# Altium project SunS_main_board.PrjPcb
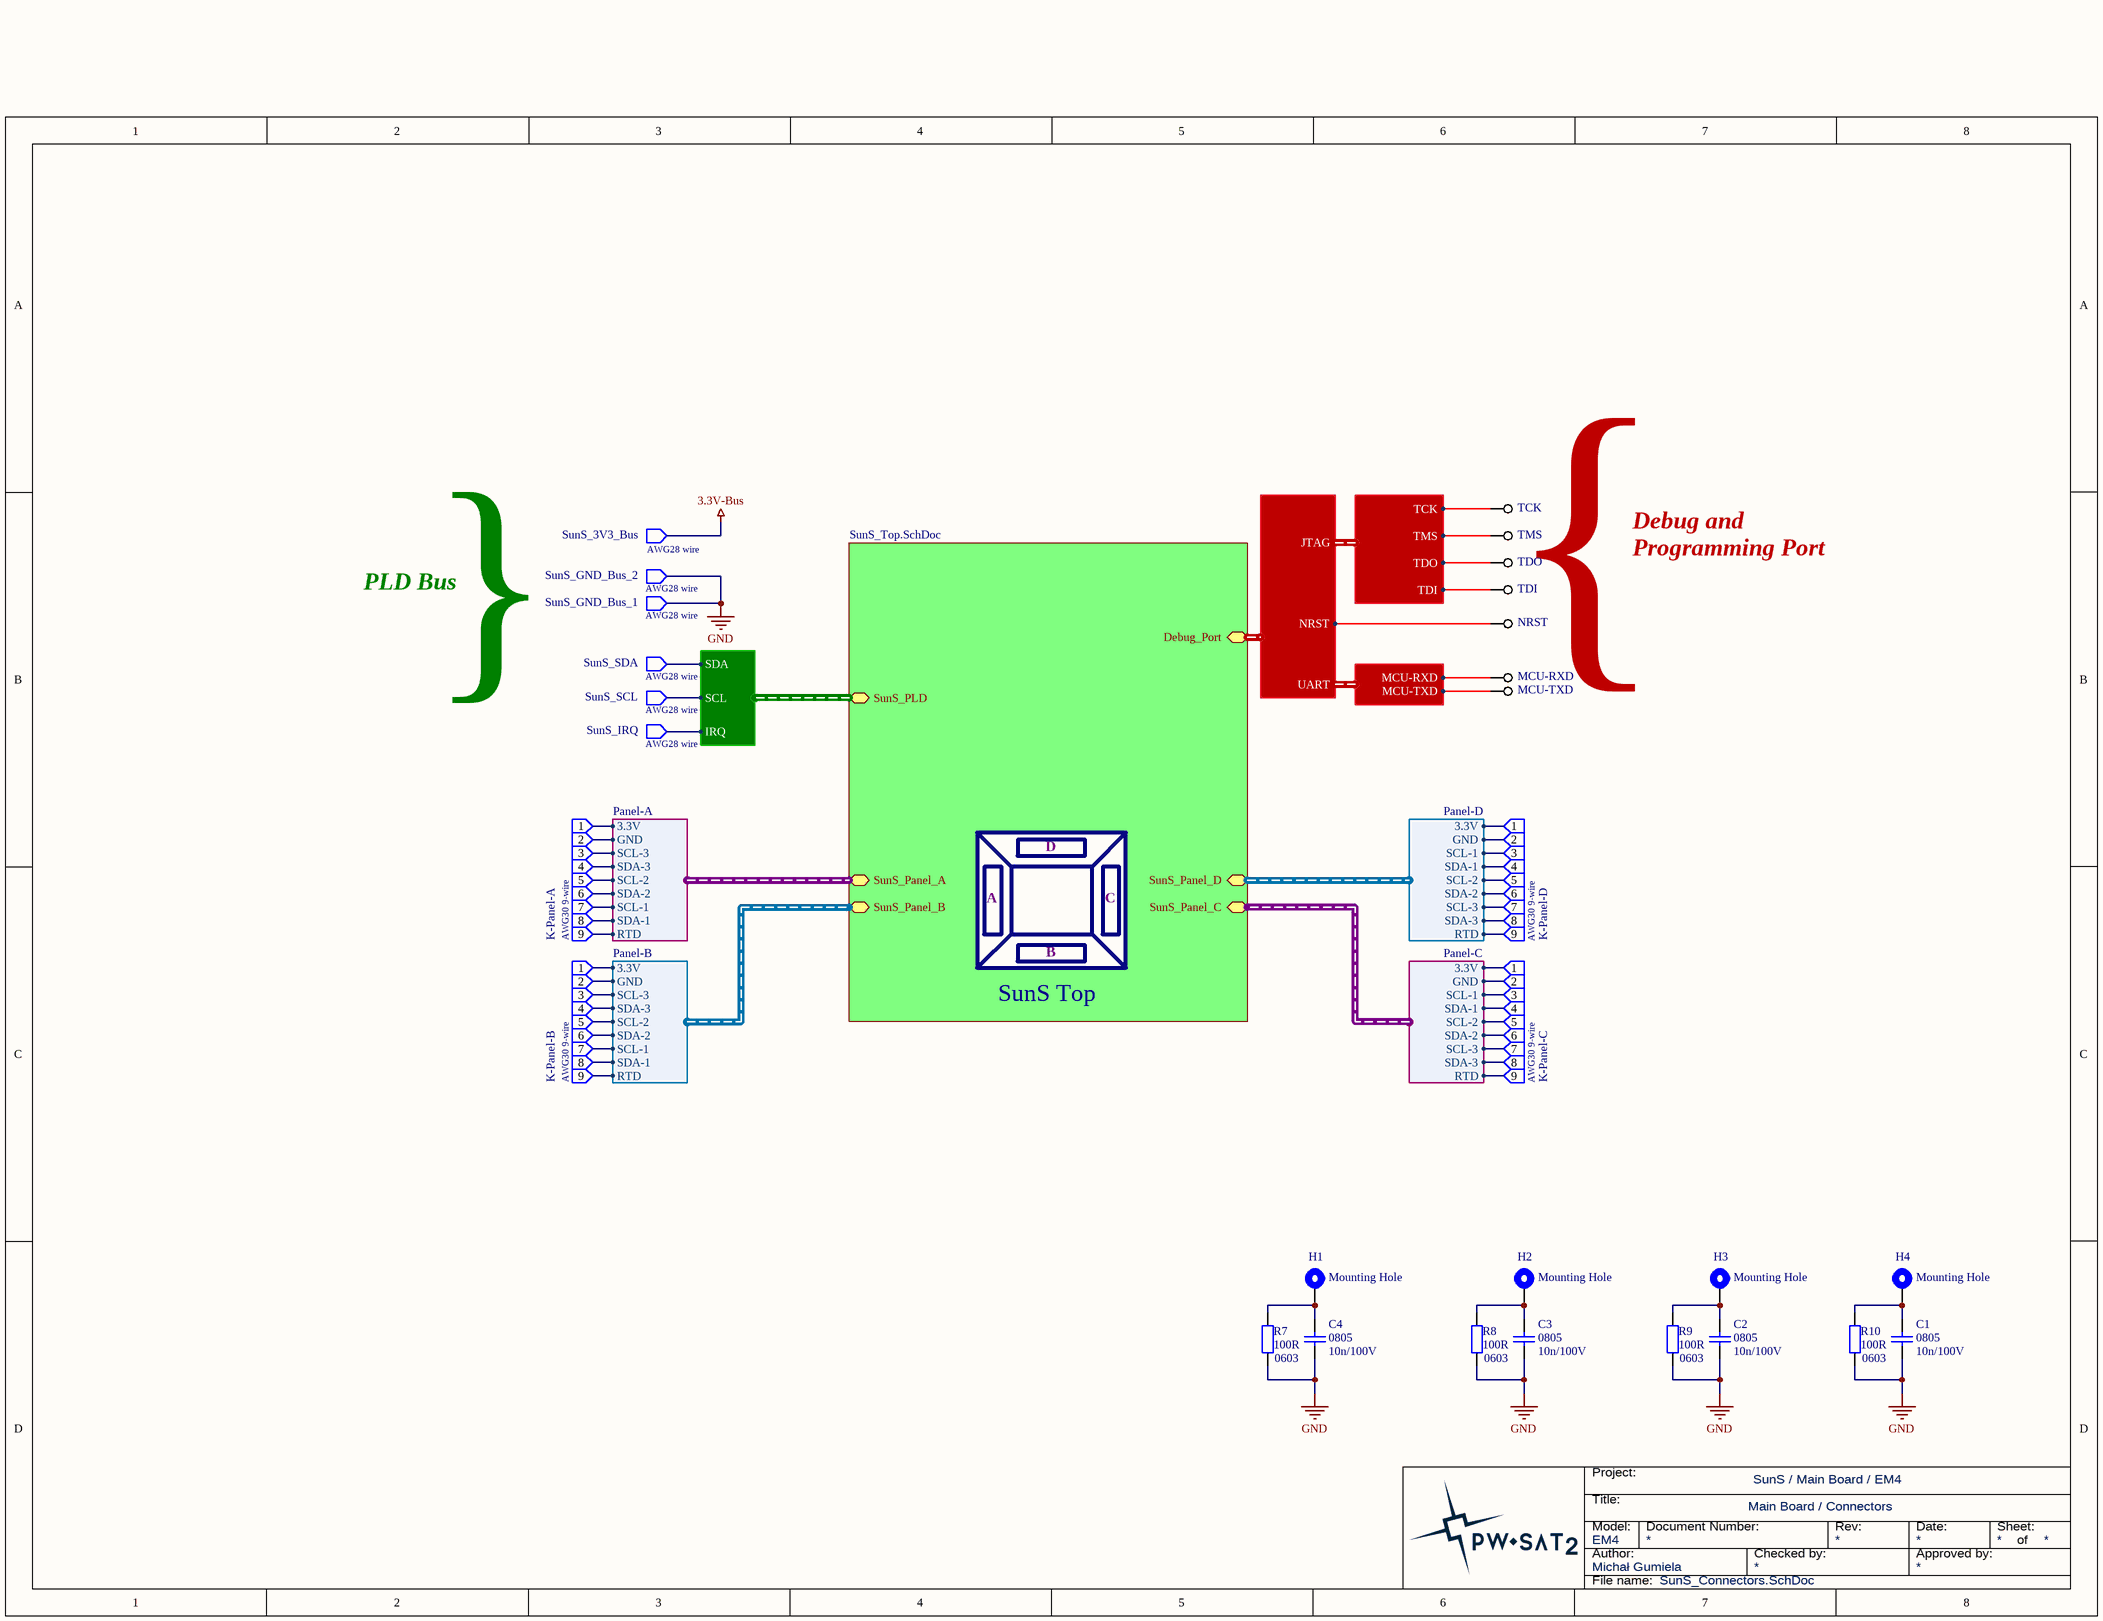
[diagram p0: SunS_Connectors.SchDoc]
ApprovedBy_Name: (not approved); Author_Name: Micha³ Gumiela; CheckedBy_Name: (not checked); Equipment: Main Board; Model: EM4; PCB_Author: (pcbdoc author); PCB_CheckedBy: (not checked); PCB_DocName: Main Board; PCB_DocNo: PWSat2-xxx-DW-xxx; PCB_Id: Main Board; PCB_Revision: 1; Project_FullName: PW-Sat2; Project_Id: SunS Main Board; Project_ShortName: SunS; Schematics_DocName: Main Board; Schematics_DocNo: PWSat2-xxx-DW-xxx; Schematics_Revision: 1; Subsystem: SunS
9 sheets, 120 parts. Net scope: hierarchical (ports join the sheet entries above them; power ports are global).
Board file: SunS_main_board.PcbDoc
Sheets:
  SunS_Connectors.SchDoc
    SunS Top = SunS_Top.SchDoc
      Microcontroller Unit = SunS_MCU.SchDoc
      Power Unit = SunS_Power_Unit.SchDoc
      RTD Analog Interface = SunS_RTD_Interface.SchDoc
      1V225_Reference = SunS_1v225_Reference.SchDoc
      Structure Thermometer = SunS_Structure_Thermometer.SchDoc
      PANELS_CONN = SunS_Panels_Interfaces.SchDoc
      ALS Interface Pull-Ups = SunS_ALS_Interface_Pull_Ups.SchDoc

## Sheet SunS_Connectors.SchDoc: Connectors
size A3; Author: Michał Gumiela; ProjectName: SunS

### Parts
C1  Package: 0805  [SMD_Capacitor_0805]  (hidden comment: 10n/100V)
C2  Package: 0805  [SMD_Capacitor_0805]  (hidden comment: 10n/100V)
C3  Package: 0805  [SMD_Capacitor_0805]  (hidden comment: 10n/100V)
C4  Package: 0805  [SMD_Capacitor_0805]  (hidden comment: 10n/100V)
H1  Mounting Hole  [SunS_PcbMntHole_M2]
H2  Mounting Hole  [SunS_PcbMntHole_M2]
H3  Mounting Hole  [SunS_PcbMntHole_M2]
H4  Mounting Hole  [SunS_PcbMntHole_M2]
K-Panel-A  AWG30 9-wire  [Wire_AWG-30_9_stress-relief]
K-Panel-B  AWG30 9-wire  [Wire_AWG-30_9_stress-relief]
K-Panel-C  AWG30 9-wire  [Wire_AWG-30_9_stress-relief]
K-Panel-D  AWG30 9-wire  [Wire_AWG-30_9_stress-relief]
MCU-RXD  Testpoint  [Testpoint pad]  (value not drawn)
MCU-TXD  Testpoint  [Testpoint pad]  (value not drawn)
NRST  Testpoint  [Testpoint pad]  (value not drawn)
R7  Package: 0603  [SMD_Resistor_0603]  (hidden comment: 100R)
R8  Package: 0603  [SMD_Resistor_0603]  (hidden comment: 100R)
R9  Package: 0603  [SMD_Resistor_0603]  (hidden comment: 100R)
R10  Package: 0603  [SMD_Resistor_0603]  (hidden comment: 100R)
SunS_3V3_Bus  AWG28 wire  [Wire_AWG-28_stress-relief]
SunS_GND_Bus_1  AWG28 wire  [Wire_AWG-28_stress-relief]
SunS_GND_Bus_2  AWG28 wire  [Wire_AWG-28_stress-relief]
SunS_IRQ  AWG28 wire  [Wire_AWG-28_stress-relief]
SunS_SCL  AWG28 wire  [Wire_AWG-28_stress-relief]
SunS_SDA  AWG28 wire  [Wire_AWG-28_stress-relief]
TCK  Testpoint  [Testpoint pad]  (value not drawn)
TDI  Testpoint  [Testpoint pad]  (value not drawn)
TDO  Testpoint  [Testpoint pad]  (value not drawn)
TMS  Testpoint  [Testpoint pad]  (value not drawn)

### Sub-sheets
SunS Top = SunS_Top.SchDoc: Debug_Port (harness SunS-Debug-Port), SunS_PLD (harness SunS_PLD_Bus), SunS_Panel_A (harness Panel-A), SunS_Panel_B (harness Panel-B), SunS_Panel_D (harness Panel-D), SunS_Panel_C (harness Panel-C)

### Harnesses
SunS_PLD_Bus: SCL, SDA, IRQ
SunS-UART: MCU-RXD, MCU-TXD
Panel-A: 3.3V, GND, SDA-1, SCL-1, SDA-2, SCL-2, SDA-3, SCL-3, RTD
Panel-B: 3.3V, GND, SDA-1, SCL-1, SDA-2, SCL-2, SDA-3, SCL-3, RTD
Panel-D: 3.3V, GND, SDA-1, SCL-1, SDA-2, SCL-2, SDA-3, SCL-3, RTD
Panel-C: 3.3V, GND, SDA-1, SCL-1, SDA-2, SCL-2, SDA-3, SCL-3, RTD
SunS-Debug-Port: NRST, UART, JTAG
JTAG: TDO, TDI, TMS, TCK

### Nets
3.3V-Bus: SunS_3V3_Bus.1
GND: C1.2 C2.2 C3.2 C4.2 R7.2 R8.2 R9.2 R10.2 SunS_GND_Bus_1.1 SunS_GND_Bus_2.1
AT_NRST: NRST.1(TP) ; sheet SunS Top/Debug_Port.NRST
MCU_RXD: MCU-RXD.1(TP) ; harness SunS-UART.MCU-RXD
MCU_TXD: MCU-TXD.1(TP) ; harness SunS-UART.MCU-TXD
RTD-Panel-A_: K-Panel-A.9 ; sheet SunS Top/SunS_Panel_A.RTD
RTD-Panel-B_: K-Panel-B.9 ; sheet SunS Top/SunS_Panel_B.RTD
RTD-Panel-C_: K-Panel-C.9 ; sheet SunS Top/SunS_Panel_C.RTD
RTD-Panel-D_: K-Panel-D.9 ; sheet SunS Top/SunS_Panel_D.RTD
SCL-1_: K-Panel-A.7 K-Panel-B.7 K-Panel-C.3 K-Panel-D.3 ; sheet SunS Top/SunS_Panel_A.SCL-1, sheet SunS Top/SunS_Panel_B.SCL-1, sheet SunS Top/SunS_Panel_D.SCL-1, sheet SunS Top/SunS_Panel_C.SCL-1
SCL-2_: K-Panel-A.5 K-Panel-B.5 K-Panel-C.5 K-Panel-D.5 ; sheet SunS Top/SunS_Panel_A.SCL-2, sheet SunS Top/SunS_Panel_B.SCL-2, sheet SunS Top/SunS_Panel_D.SCL-2, sheet SunS Top/SunS_Panel_C.SCL-2
SCL-3_: K-Panel-A.3 K-Panel-B.3 K-Panel-C.7 K-Panel-D.7 ; sheet SunS Top/SunS_Panel_A.SCL-3, sheet SunS Top/SunS_Panel_B.SCL-3, sheet SunS Top/SunS_Panel_D.SCL-3, sheet SunS Top/SunS_Panel_C.SCL-3
SDA-Panel-A-1_: K-Panel-A.8 ; sheet SunS Top/SunS_Panel_A.SDA-1
SDA-Panel-A-2_: K-Panel-A.6 ; sheet SunS Top/SunS_Panel_A.SDA-2
SDA-Panel-A-3_: K-Panel-A.4 ; sheet SunS Top/SunS_Panel_A.SDA-3
SDA-Panel-B-1_: K-Panel-B.8 ; sheet SunS Top/SunS_Panel_B.SDA-1
SDA-Panel-B-2_: K-Panel-B.6 ; sheet SunS Top/SunS_Panel_B.SDA-2
SDA-Panel-B-3_: K-Panel-B.4 ; sheet SunS Top/SunS_Panel_B.SDA-3
SDA-Panel-C-1_: K-Panel-C.4 ; sheet SunS Top/SunS_Panel_C.SDA-1
SDA-Panel-C-2_: K-Panel-C.6 ; sheet SunS Top/SunS_Panel_C.SDA-2
SDA-Panel-C-3_: K-Panel-C.8 ; sheet SunS Top/SunS_Panel_C.SDA-3
SDA-Panel-D-1_: K-Panel-D.4 ; sheet SunS Top/SunS_Panel_D.SDA-1
SDA-Panel-D-2_: K-Panel-D.6 ; sheet SunS Top/SunS_Panel_D.SDA-2
SDA-Panel-D-3_: K-Panel-D.8 ; sheet SunS Top/SunS_Panel_D.SDA-3
TCK: TCK.1(TP) ; harness JTAG.TCK
TDI: TDI.1(TP) ; harness JTAG.TDI
TDO: TDO.1(TP) ; harness JTAG.TDO
TMS: TMS.1(TP) ; harness JTAG.TMS
NetALS_C1_1: K-Panel-A.2 ; sheet SunS Top/SunS_Panel_A.GND
NetALS_C2_2: K-Panel-A.1 ; sheet SunS Top/SunS_Panel_A.3.3V
NetALS_C3_1: K-Panel-B.2 ; sheet SunS Top/SunS_Panel_B.GND
NetALS_C4_2: K-Panel-B.1 ; sheet SunS Top/SunS_Panel_B.3.3V
NetALS_C5_1: K-Panel-D.2 ; sheet SunS Top/SunS_Panel_D.GND
NetALS_C6_2: K-Panel-D.1 ; sheet SunS Top/SunS_Panel_D.3.3V
NetALS_C7_1: K-Panel-C.2 ; sheet SunS Top/SunS_Panel_C.GND
NetALS_C8_2: K-Panel-C.1 ; sheet SunS Top/SunS_Panel_C.3.3V
NetC1_1: C1.1 H4.1 R10.1
NetC2_1: C2.1 H3.1 R9.1
NetC3_1: C3.1 H2.1 R8.1
NetC4_1: C4.1 H1.1 R7.1
NetMCU_R2_2: SunS_SCL.1 ; sheet SunS Top/SunS_PLD.SCL
NetMCU_R3_2: SunS_SDA.1 ; sheet SunS Top/SunS_PLD.SDA
NetMCU_R5_2: SunS_IRQ.1 ; sheet SunS Top/SunS_PLD.IRQ

### Notes on the sheet
- }
- {
- Debug and
- Programming Port
- PLD Bus
- D
- A
- B
- C
- Title:
- Project:
- Author:
- Model:
- Document Number:
- Checked by:
- Rev:
- Date:
- Approved by:
- Sheet:
- of
- File name:

### Library data of the parts
C1-C4 = Cer_C0805T104K1RCLTU: Ceramic Cap Kemet COTS 100n/100V X7R 0805; ManufacturerPartNumber: C0805T104K1RCLTU; Manufacturer: Kemet; Value: 10n/100V
H1-H4 = MntHole: PCB Mounting Hole; Value: Mounting Hole
K-Panel-A K-Panel-B K-Panel-C K-Panel-D = wire-awg30-9: 9 x wire AWG30 solder point.; Value: AWG30 9-wire
R7-R10 = Res: Value: 100R
SunS_3V3_Bus SunS_GND_Bus_1 SunS_GND_Bus_2 SunS_IRQ SunS_SCL SunS_SDA = wire-awg30-1: Single wire AWG28 solder point.; Value: AWG28 wire

## Sheet SunS_Top.SchDoc: Sun Sensor build with digital ALS
size A3; Author: Michał Gumiela; SheetNumber: 1; SheetTotal: 9; PageSetup: Record=PageOptions|CenterHorizontal=True|CenterVertical=True|PrintScale=0.71|XCorrection=1.00|YCorrection=1.00|PrintKind=0|BorderSize=5000000|LeftOffset=0|BottomOffset=0|Orientation=2|PaperLength=1000|PaperWidth=1000|Scale=100|PaperSource=7|PrintQuality=-3|MediaType=1|DitherType=10|PrintScaleMode=1|PaperKind=A4|PaperIndex=9
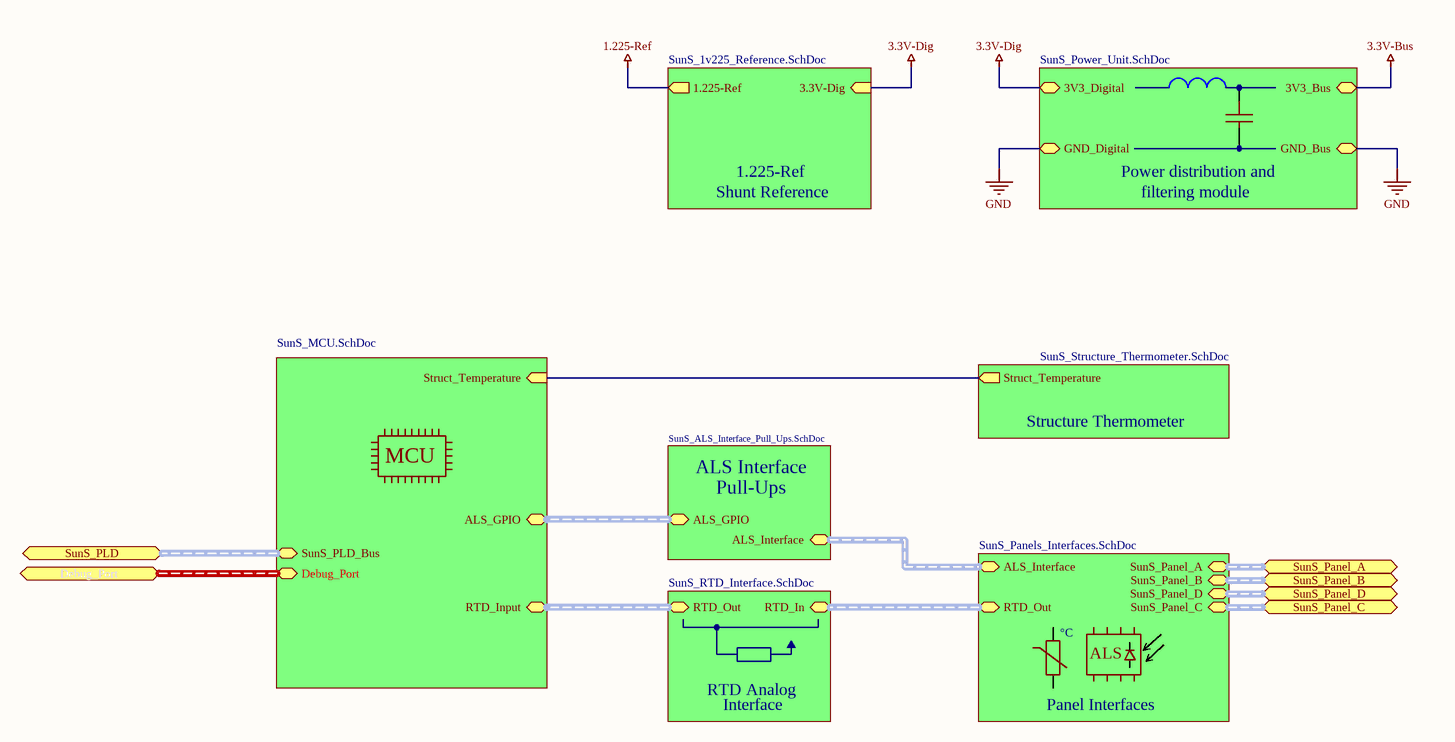
[diagram p1: SunS_Top.SchDoc]

### Sub-sheets
1V225_Reference = SunS_1v225_Reference.SchDoc: 3.3V-Dig (in), 1.225-Ref (out)
ALS Interface Pull-Ups = SunS_ALS_Interface_Pull_Ups.SchDoc: ALS_Interface (harness SunS_ALS_Interface), ALS_GPIO (harness SunS_ALS_GPIO)
Microcontroller Unit = SunS_MCU.SchDoc: RTD_Input (harness SunS_RTD_Interface), ALS_GPIO (harness SunS_ALS_GPIO), SunS_PLD_Bus (harness SunS_PLD_Bus), Struct_Temperature (in), Debug_Port (harness SunS-Debug-Port)
PANELS_CONN = SunS_Panels_Interfaces.SchDoc: ALS_Interface (harness SunS_ALS_Interface), RTD_Out (harness SunS_RTD_Interface), SunS_Panel_A (harness Panel-A), SunS_Panel_B (harness Panel-B), SunS_Panel_C (harness Panel-C), SunS_Panel_D (harness Panel-D)
Power Unit = SunS_Power_Unit.SchDoc: 3V3_Digital, 3V3_Bus, GND_Bus, GND_Digital
RTD Analog Interface = SunS_RTD_Interface.SchDoc: RTD_In (harness SunS_RTD_Interface), RTD_Out (harness SunS_RTD_Interface)
Structure Thermometer = SunS_Structure_Thermometer.SchDoc: Struct_Temperature (out)

### Ports
Debug_Port (harness SunS_PLD_I2C), SunS_Panel_A (harness SunS_Panel_A), SunS_Panel_B (harness SunS_Panel_B), SunS_Panel_C (harness SunS_Panel_C), SunS_Panel_D (harness SunS_Panel_D), SunS_PLD (harness SunS_PLD_Bus)

### Nets
3.3V-Dig: sheet Power Unit/3V3_Digital, sheet 1V225_Reference/3.3V-Dig
GND: sheet Power Unit/GND_Bus, sheet Power Unit/GND_Digital
NetMCU_U1_33: sheet Microcontroller Unit/Struct_Temperature, sheet Structure Thermometer/Struct_Temperature

### Buses and harness runs
harness port Debug_Port = sheet Microcontroller Unit/Debug_Port
harness port SunS_Panel_A = sheet PANELS_CONN/SunS_Panel_A
harness port SunS_Panel_B = sheet PANELS_CONN/SunS_Panel_B
harness port SunS_Panel_C = sheet PANELS_CONN/SunS_Panel_C
harness port SunS_Panel_D = sheet PANELS_CONN/SunS_Panel_D
harness port SunS_PLD = sheet Microcontroller Unit/SunS_PLD_Bus
harness sheet ALS Interface Pull-Ups/ALS_GPIO = sheet Microcontroller Unit/ALS_GPIO
harness sheet ALS Interface Pull-Ups/ALS_Interface = sheet PANELS_CONN/ALS_Interface
harness sheet Microcontroller Unit/RTD_Input = sheet RTD Analog Interface/RTD_Out
harness sheet PANELS_CONN/RTD_Out = sheet RTD Analog Interface/RTD_In

### Notes on the sheet
- Shunt Reference
- 1.225-Ref
- Power distribution and
- filtering module
- MCU
- ALS Interface
- Pull-Ups
- °C
- ALS
- RTD Analog
- Interface
- Panel Interfaces
- Title:
- Project:
- Author:
- Model:
- Document Number:
- Checked by:
- Rev:
- Date:
- Approved by:
- Sheet:
- of
- File name:

## Sheet SunS_MCU.SchDoc
size A2
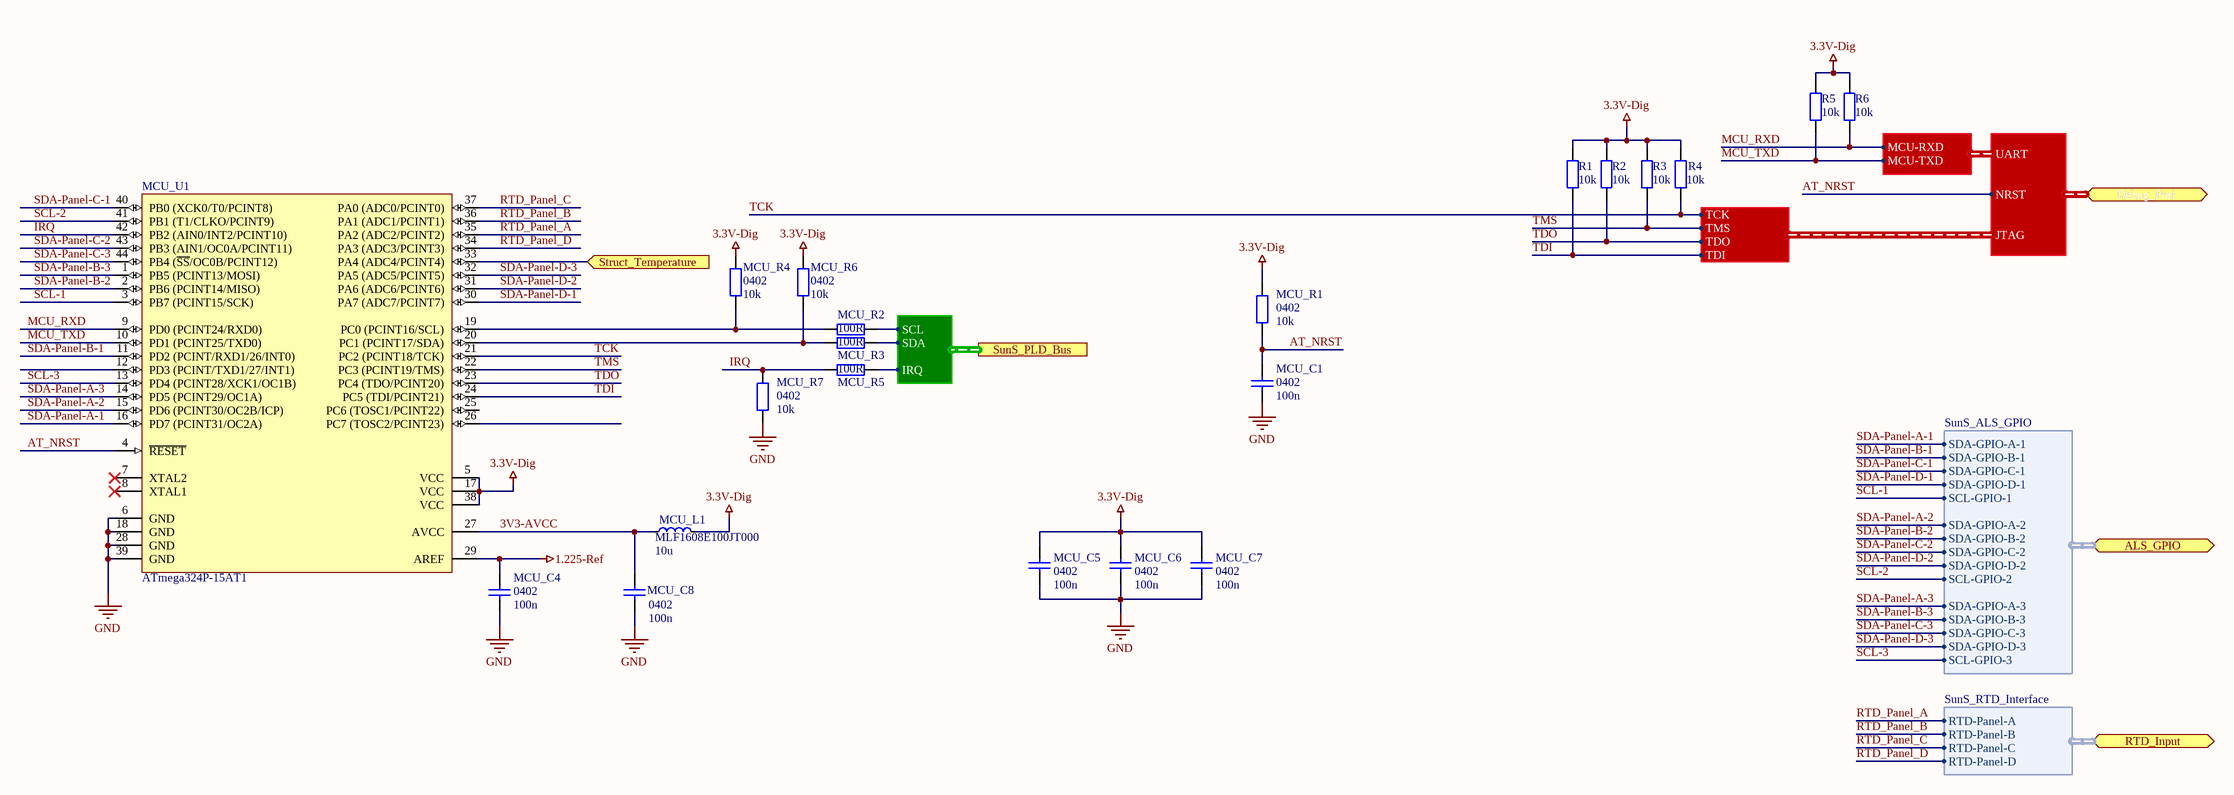
[diagram p2: SunS_MCU.SchDoc]

### Parts
MCU_C1  0402  value 100n  [SMD_Capacitor_0402]
MCU_C4  0402  value 100n  [SMD_Capacitor_0402]
MCU_C5  0402  value 100n  [SMD_Capacitor_0402]
MCU_C6  0402  value 100n  [SMD_Capacitor_0402]
MCU_C7  0402  value 100n  [SMD_Capacitor_0402]
MCU_C8  0402  value 100n  [SMD_Capacitor_0402]
MCU_L1  Manufacturer Part Number: MLF1608E100JT000  [0603]  (hidden comment: 10u)
MCU_R1  0402  value 10k  [SMD_Capacitor_0402]
MCU_R2  100R  [SMD_Resistor_0402]
MCU_R3  100R  [SMD_Resistor_0402]
MCU_R4  0402  value 10k  [SMD_Capacitor_0402]
MCU_R5  100R  [SMD_Resistor_0402]
MCU_R6  0402  value 10k  [SMD_Capacitor_0402]
MCU_R7  0402  value 10k  [SMD_Capacitor_0402]
MCU_U1  ATmega324P-15AT1  [TQFP-44]
R1  10k  [SMD_Resistor_0402]
R2  10k  [SMD_Resistor_0402]
R3  10k  [SMD_Resistor_0402]
R4  10k  [SMD_Resistor_0402]
R5  10k  [SMD_Resistor_0402]
R6  10k  [SMD_Resistor_0402]

### Ports
ALS_GPIO (harness SunS_ALS_GPIO), Debug_Port (harness SunS-Debug-Port), RTD_Input (harness SunS_RTD_Interface), Struct_Temperature (in), SunS_PLD_Bus (harness SunS_PLD_Bus)

### Harnesses
SunS_RTD_Interface: RTD-Panel-A, RTD-Panel-B, RTD-Panel-C, RTD-Panel-D
SunS-UART: MCU-RXD, MCU-TXD
SunS-Debug-Port: NRST, UART, JTAG
SunS_ALS_GPIO: SDA-GPIO-A-1, SDA-GPIO-D-1, SDA-GPIO-B-1, SDA-GPIO-C-1, SCL-GPIO-1, SDA-GPIO-A-2, SDA-GPIO-D-2, SDA-GPIO-B-2, SDA-GPIO-C-2, SCL-GPIO-2, SDA-GPIO-A-3, SDA-GPIO-D-3, SDA-GPIO-B-3, SDA-GPIO-C-3, SCL-GPIO-3
SunS_PLD_Bus: SCL, SDA, IRQ
JTAG: TDO, TDI, TMS, TCK

### Nets
1.225-Ref: MCU_C4.2 MCU_U1.29(AREF)
3.3V-Dig: MCU_C5.2 MCU_C6.2 MCU_C7.2 MCU_L1.2 MCU_R1.2 MCU_R4.2 MCU_R6.2 MCU_U1.5(VCC) MCU_U1.17(VCC) MCU_U1.38(VCC) R1.1 R2.1 R3.1 R4.1 R5.1 R6.1
GND: MCU_C1.1 MCU_C4.1 MCU_C5.1 MCU_C6.1 MCU_C7.1 MCU_C8.1 MCU_R7.1 MCU_U1.6(GND) MCU_U1.18(GND) MCU_U1.28(GND) MCU_U1.39(GND)
3V3-AVCC: MCU_C8.2 MCU_L1.1 MCU_U1.27(AVCC)
AT_NRST: MCU_C1.2 MCU_R1.1 MCU_U1.4(~{RESET}) ; port Debug_Port.NRST
IRQ: MCU_R5.1 MCU_R7.2 MCU_U1.42(PB2_(AIN0/INT2/PCINT10))
MCU_RXD: MCU_U1.9(PD0_(PCINT24/RXD0)) R6.2 ; harness SunS-UART.MCU-RXD
MCU_TXD: MCU_U1.10(PD1_(PCINT25/TXD0)) R5.2 ; harness SunS-UART.MCU-TXD
RTD_Panel_A: MCU_U1.35(PA2_(ADC2/PCINT2)) ; port RTD_Input.RTD-Panel-A
RTD_Panel_B: MCU_U1.36(PA1_(ADC1/PCINT1)) ; port RTD_Input.RTD-Panel-B
RTD_Panel_C: MCU_U1.37(PA0_(ADC0/PCINT0)) ; port RTD_Input.RTD-Panel-C
RTD_Panel_D: MCU_U1.34(PA3_(ADC3/PCINT3)) ; port RTD_Input.RTD-Panel-D
SCL-1: MCU_U1.3(PB7_(PCINT15/SCK)) ; port ALS_GPIO.SCL-GPIO-1
SCL-2: MCU_U1.41(PB1_(T1/CLKO/PCINT9)) ; port ALS_GPIO.SCL-GPIO-2
SCL-3: MCU_U1.13(PD4_(PCINT28/XCK1/OC1B)) ; port ALS_GPIO.SCL-GPIO-3
SDA-Panel-A-1: MCU_U1.16(PD7_(PCINT31/OC2A)) ; port ALS_GPIO.SDA-GPIO-A-1
SDA-Panel-A-2: MCU_U1.15(PD6_(PCINT30/OC2B/ICP)) ; port ALS_GPIO.SDA-GPIO-A-2
SDA-Panel-A-3: MCU_U1.14(PD5_(PCINT29/OC1A)) ; port ALS_GPIO.SDA-GPIO-A-3
SDA-Panel-B-1: MCU_U1.11(PD2_(PCINT/RXD1/26/INT0)) ; port ALS_GPIO.SDA-GPIO-B-1
SDA-Panel-B-2: MCU_U1.2(PB6_(PCINT14/MISO)) ; port ALS_GPIO.SDA-GPIO-B-2
SDA-Panel-B-3: MCU_U1.1(PB5_(PCINT13/MOSI)) ; port ALS_GPIO.SDA-GPIO-B-3
SDA-Panel-C-1: MCU_U1.40(PB0_(XCK0/T0/PCINT8)) ; port ALS_GPIO.SDA-GPIO-C-1
SDA-Panel-C-2: MCU_U1.43(PB3_(AIN1/OC0A/PCINT11)) ; port ALS_GPIO.SDA-GPIO-C-2
SDA-Panel-C-3: MCU_U1.44(PB4_(~{SS}/OC0B/PCINT12)) ; port ALS_GPIO.SDA-GPIO-C-3
SDA-Panel-D-1: MCU_U1.30(PA7_(ADC7/PCINT7)) ; port ALS_GPIO.SDA-GPIO-D-1
SDA-Panel-D-2: MCU_U1.31(PA6_(ADC6/PCINT6)) ; port ALS_GPIO.SDA-GPIO-D-2
SDA-Panel-D-3: MCU_U1.32(PA5_(ADC5/PCINT5)) ; port ALS_GPIO.SDA-GPIO-D-3
TCK: MCU_U1.21(PC2_(PCINT18/TCK)) R4.2 ; harness JTAG.TCK
TDI: MCU_U1.24(PC5_(TDI/PCINT21)) R1.2 ; harness JTAG.TDI
TDO: MCU_U1.23(PC4_(TDO/PCINT20)) R2.2 ; harness JTAG.TDO
TMS: MCU_U1.22(PC3_(PCINT19/TMS)) R3.2 ; harness JTAG.TMS
NetMCU_R2_1: MCU_R2.1 MCU_R4.1 MCU_U1.19(PC0_(PCINT16/SCL))
NetMCU_R2_2: MCU_R2.2 ; port SunS_PLD_Bus.SCL
NetMCU_R3_1: MCU_R3.1 MCU_R6.1 MCU_U1.20(PC1_(PCINT17/SDA))
NetMCU_R3_2: MCU_R3.2 ; port SunS_PLD_Bus.SDA
NetMCU_R5_2: MCU_R5.2 ; port SunS_PLD_Bus.IRQ
NetMCU_U1_33: MCU_U1.33(PA4_(ADC4/PCINT4)) ; port Struct_Temperature

Not connected (* = marked no-connect by the designer): MCU_U1 7(XTAL2)* 8(XTAL1)* 12(PD3_(PCINT/TXD1/27/INT1)) 25(PC6_(TOSC1/PCINT22)) 26(PC7_(TOSC2/PCINT23))

### Notes on the sheet
- Title:
- Project:
- Author:
- Model:
- File name:
- Document Number:
- Checked by:
- Rev:
- Date:
- Approved by:
- Sheet:
- of

### Library data of the parts
MCU_C1 MCU_C4-MCU_C8 = Cap: Capacitor; Published: 8-Jun-2000; LatestRevisionDate: 17-Jul-2002; LatestRevisionNote: Re-released for DXP Platform.; PackageReference: RAD-0.3; Publisher: Altium Limited; PackageDescription: Radial Cap, Thru-Hole; 2 Leads; 0.3 in Pin Spacing
MCU_L1 = Inductor: Generic Inductor; Manufacturer: TDK; value: 10u
MCU_R1 MCU_R4 MCU_R6 MCU_R7 = Res2: Resistor; Published: 8-Jun-2000; LatestRevisionDate: 17-Jul-2002; LatestRevisionNote: Re-released for DXP Platform.; PackageReference: AXIAL-0.4; Publisher: Altium Limited; PackageDescription: Axial Device, Thru-Hole; 2 Leads; 0.4 in Pin Spacing
MCU_R2 MCU_R3 MCU_R5 = CRCW0402100RFKxxxx: 100R/1% Vishay CRCW 0402 Resistor. 63mW, 100ppm, 50V.; Manufacturer: Vishay; ManufacturerPartNumber: CRCW0402100RFKxxxx; Value: 100R; Package: 0402
MCU_U1 = ATmega324P-15AT1: 8-bit Automotive AVR Microcontroller, 32KB Flash, 1KB EEPROM, 2KB SRAM, Reduced Automotive Grade (-40°C to +105°C), 44-Pin TQFP; DatasheetVersion: revF, Sep-2009; PackageVersion: rev.G, Jul-2007; PackageReference: 44ML; PackageDescription: 44-Pin Plastic Thin Quad Flat Pack, 10 x 10 x 1.0 mm Body, 0.8 mm Pitch (TQFP); ComponentLink1Description: Manufacturer URL; ComponentLink1URL: http://www.atmel.com/; ComponentLink2Description: ATmega164P/324P/644P Datasheet; ComponentLink2URL: http://www.atmel.com/dyn/resources/prod_documents/doc7674.pdf; ComponentLink3Description: ATmega164P/324P/644P Summary; ComponentLink3URL: http://www.atmel.com/dyn/resources/prod_documents/7674S.pdf
R1-R6 = Res: Value: 10k; Package: 0402

## Sheet SunS_Power_Unit.SchDoc: Power filtration
size A4
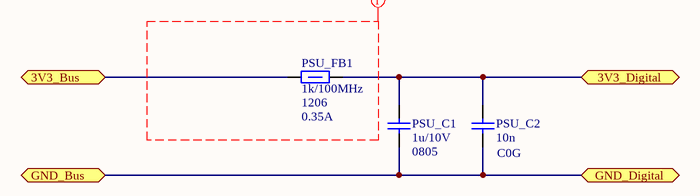
[diagram p3: SunS_Power_Unit.SchDoc]

### Parts
PSU_C1  value 1u/10V  Package: 0805  [SMD_Capacitor_0805]  (hidden comment: Cap)
PSU_C2  value 10n  Dielectric: C0G  [SMD_Capacitor_0402]  (hidden comment: Cap)
PSU_FB1  Package: 1206  Current Rating: 0.35A  [SMD_FerriteBead_1206]  (hidden comment: 1k/100MHz)

### Ports
3V3_Bus, 3V3_Digital, GND_Bus, GND_Digital

### Nets
3.3V-Bus: PSU_FB1.2 ; port 3V3_Bus
3.3V-Dig: PSU_C1.1 PSU_C2.1 PSU_FB1.1 ; port 3V3_Digital
GND: PSU_C1.2 PSU_C2.2 ; port GND_Digital, port GND_Bus

### Layout directives
net class PWR: (no net found under the mark)

### Notes on the sheet
- Title:
- Project:
- Author:
- Model:
- Document Number:
- Checked by:
- Rev:
- Date:
- Approved by:
- Sheet:
- of
- File name:

### Library data of the parts
PSU_FB1 = BLM15AX102SN1D: Ferrite bead, 0402, 0.49OHM, 0.35A.; Manufacturer: Murata; Series Resistance DC: 0.49R; ManufacturerPartNumber: BLM15AX102SN1D; Value: 1k/100MHz
PSU_C1 PSU_C2 = Cap
  PSU_C2: Package: 0402

## Sheet SunS_RTD_Interface.SchDoc: RTD Interface
size A3
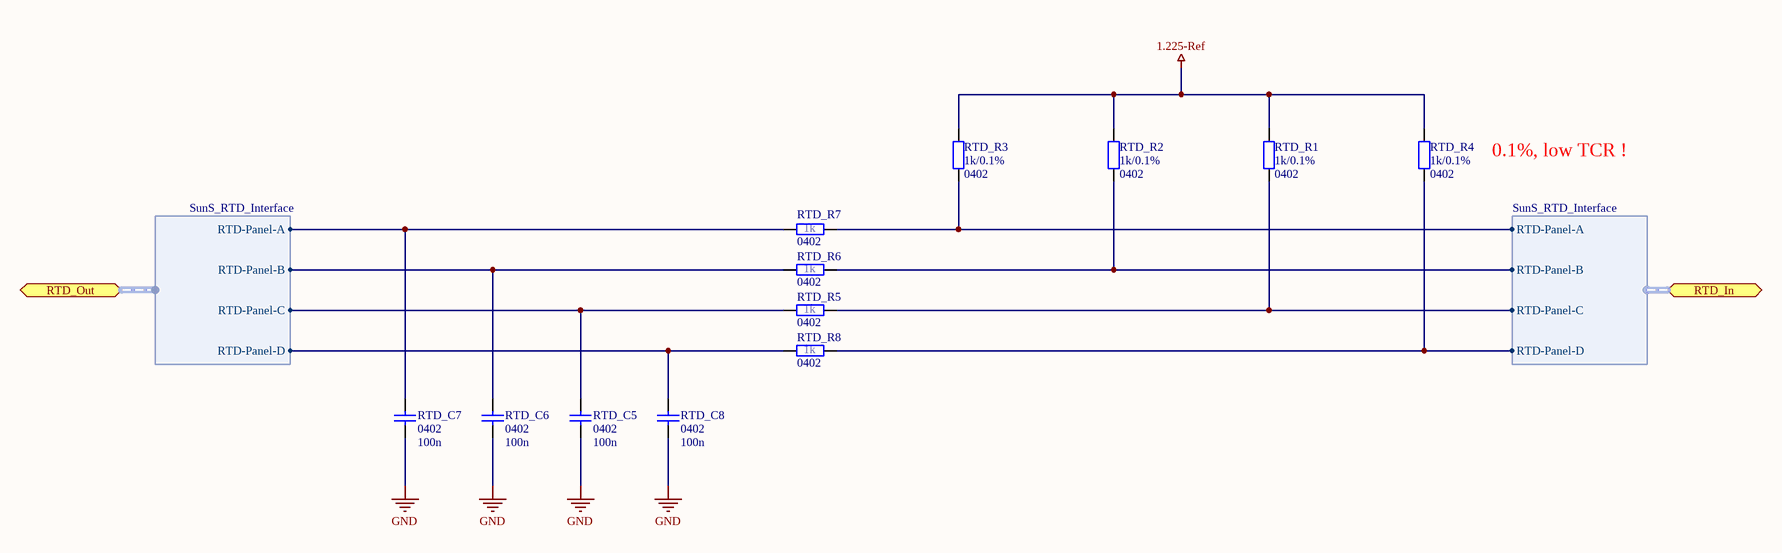
[diagram p4: SunS_RTD_Interface.SchDoc]

### Parts
RTD_C5  0402  value 100n  [SMD_Capacitor_0402]
RTD_C6  0402  value 100n  [SMD_Capacitor_0402]
RTD_C7  0402  value 100n  [SMD_Capacitor_0402]
RTD_C8  0402  value 100n  [SMD_Capacitor_0402]
RTD_R1  Package: 0402  [SMD_Resistor_0402]  (hidden comment: 1k/0.1%)
RTD_R2  Package: 0402  [SMD_Resistor_0402]  (hidden comment: 1k/0.1%)
RTD_R3  Package: 0402  [SMD_Resistor_0402]  (hidden comment: 1k/0.1%)
RTD_R4  Package: 0402  [SMD_Resistor_0402]  (hidden comment: 1k/0.1%)
RTD_R5  Package: 0402  [SMD_Resistor_0402]  (hidden comment: 1k)
RTD_R6  Package: 0402  [SMD_Resistor_0402]  (hidden comment: 1k)
RTD_R7  Package: 0402  [SMD_Resistor_0402]  (hidden comment: 1k)
RTD_R8  Package: 0402  [SMD_Resistor_0402]  (hidden comment: 1k)

### Ports
RTD_In (harness SunS_RTD_Interface), RTD_Out (harness SunS_RTD_Interface)

### Harnesses
SunS_RTD_Interface: RTD-Panel-A, RTD-Panel-B, RTD-Panel-C, RTD-Panel-D

### Nets
1.225-Ref: RTD_R1.1 RTD_R2.1 RTD_R3.1 RTD_R4.1
GND: RTD_C5.1 RTD_C6.1 RTD_C7.1 RTD_C8.1
RTD-Panel-A_: RTD_R3.2 RTD_R7.1 ; port RTD_In.RTD-Panel-A
RTD-Panel-B_: RTD_R2.2 RTD_R6.1 ; port RTD_In.RTD-Panel-B
RTD-Panel-C_: RTD_R1.2 RTD_R5.1 ; port RTD_In.RTD-Panel-C
RTD-Panel-D_: RTD_R4.2 RTD_R8.1 ; port RTD_In.RTD-Panel-D
RTD_Panel_A: RTD_C7.2 RTD_R7.2 ; port RTD_Out.RTD-Panel-A
RTD_Panel_B: RTD_C6.2 RTD_R6.2 ; port RTD_Out.RTD-Panel-B
RTD_Panel_C: RTD_C5.2 RTD_R5.2 ; port RTD_Out.RTD-Panel-C
RTD_Panel_D: RTD_C8.2 RTD_R8.2 ; port RTD_Out.RTD-Panel-D

### Notes on the sheet
- 0.1%, low TCR !
- Title:
- Project:
- Author:
- Model:
- Document Number:
- Checked by:
- Rev:
- Date:
- Approved by:
- Sheet:
- of
- File name:

### Library data of the parts
RTD_C5-RTD_C8 = Cap: Capacitor; Published: 8-Jun-2000; LatestRevisionDate: 17-Jul-2002; LatestRevisionNote: Re-released for DXP Platform.; PackageReference: RAD-0.3; Publisher: Altium Limited; PackageDescription: Radial Cap, Thru-Hole; 2 Leads; 0.3 in Pin Spacing
RTD_R1-RTD_R8 = CRCW04021K00FKxxxx: 1k/1% Vishay CRCW 0402 Resistor. 63mW, 100ppm, 50V.; Manufacturer: Vishay; ManufacturerPartNumber: CRCW04021K00FKxxxx
  RTD_R1-RTD_R4: Value: 1k/0.1%
  RTD_R5-RTD_R8: Value: 1k

## Sheet SunS_1v225_Reference.SchDoc: 2.0V Reference
size A4
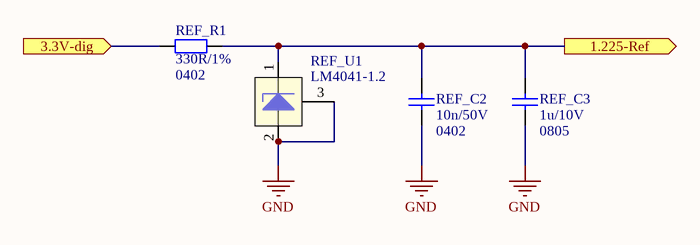
[diagram p5: SunS_1v225_Reference.SchDoc]

### Parts
REF_C2  Package: 0402  [SMD_Capacitor_0402]  (hidden comment: 10n/50V)
REF_C3  value 1u/10V  Package: 0805  [SMD_Capacitor_0805]  (hidden comment: Cap)
REF_R1  Package: 0402  [SMD_Resistor_0402]  (hidden comment: 330R/1%)
REF_U1  LM4041-1.2  [SOT23-3]

### Ports
1.225-Ref (out), 3.3V-dig (in)

### Nets
1.225-Ref: REF_C2.1 REF_C3.1 REF_R1.2 REF_U1.1(K) ; port 1.225-Ref
3.3V-Dig: REF_R1.1 ; port 3.3V-dig
GND: REF_C2.2 REF_C3.2 REF_U1.2(A) REF_U1.3(NC)

### Notes on the sheet
- Title:
- Project:
- Author:
- Model:
- Document Number:
- Checked by:
- Rev:
- Date:
- Approved by:
- Sheet:
- of
- File name:

### Library data of the parts
REF_C2 = Cer_C0402T103K5RALTU: Ceramic Cap Kemet COTS 10n/50V X7R 0402; ManufacturerPartNumber: C0402T103K5RALTU; Manufacturer: Kemet; Value: 10n/50V
REF_R1 = CRCW04021K00FKxxxx: as RTD_R1 on sheet SunS_RTD_Interface; Manufacturer: Vishay; ManufacturerPartNumber: CRCW04021K00FKxxxx; Value: 330R/1%
REF_U1 = LM4041AIM3X-1.2/NOPB: Shunt FIXED V-REF, 1.225V; Manufacturer: Texas Instruments; ManufacturerPartNumber: LM4041AIM3X-1.2/NOPB; HelpURL: http://www.ti.com/lit/ds/symlink/lm4041c.pdf; Value: LM4041-1.2

## Sheet SunS_Structure_Thermometer.SchDoc: Structure thermometer
size A4; PageSetup: Record=PageOptions|CenterHorizontal=True|CenterVertical=True|PrintScale=1.00|XCorrection=1.00|YCorrection=1.00|PrintKind=0|BorderSize=5000000|LeftOffset=0|BottomOffset=0|Orientation=2|PaperLength=1000|PaperWidth=1000|Scale=100|PaperSource=7|PrintQuality=-3|MediaType=1|DitherType=10|PrintScaleMode=1|PaperKind=A4|PaperIndex=9
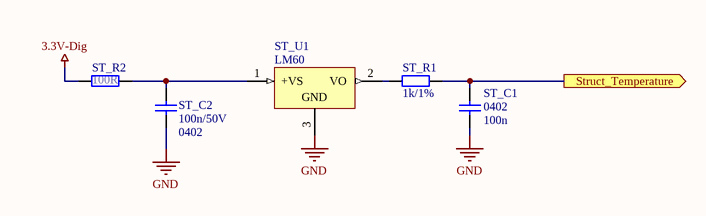
[diagram p6: SunS_Structure_Thermometer.SchDoc]

### Parts
ST_C1  0402  value 100n  [SMD_Capacitor_0402]
ST_C2  Package: 0402  [SMD_Capacitor_0402]  (hidden comment: 100n/50V)
ST_R1  1k/1%  [SMD_Resistor_0402]
ST_R2  100R  [SMD_Resistor_0402]
ST_U1  LM60  [SOT23-3]

### Ports
Struct_Temperature (out)

### Nets
3.3V-Dig: ST_R2.1
GND: ST_C1.1 ST_C2.2 ST_U1.3(GND)
NetMCU_U1_33: ST_C1.2 ST_R1.2 ; port Struct_Temperature
NetST_C2_1: ST_C2.1 ST_R2.2 ST_U1.1(+VS)
NetST_R1_1: ST_R1.1 ST_U1.2(VO)

### Notes on the sheet
- Title:
- Project:
- Author:
- Model:
- Document Number:
- Checked by:
- Rev:
- Date:
- Approved by:
- Sheet:
- of
- File name:

### Library data of the parts
ST_C1 = Cap: Capacitor; Published: 8-Jun-2000; LatestRevisionDate: 17-Jul-2002; LatestRevisionNote: Re-released for DXP Platform.; PackageReference: RAD-0.3; Publisher: Altium Limited; PackageDescription: Radial Cap, Thru-Hole; 2 Leads; 0.3 in Pin Spacing
ST_C2 = Cer_C0402T103K5RALTU: Ceramic Cap Kemet COTS 10n/50V X7R 0402; ManufacturerPartNumber: C0402T103K5RALTU; Manufacturer: Kemet; Value: 100n/50V
ST_R1 ST_R2 = CRCW04021K00FKxxxx: as RTD_R1 on sheet SunS_RTD_Interface; Manufacturer: Vishay; ManufacturerPartNumber: CRCW04021K00FKxxxx; Package: 0402
  ST_R1: Value: 1k/1%
  ST_R2: Value: 100R
ST_U1 = LM60: Analog temperature sensor

## Sheet SunS_Panels_Interfaces.SchDoc: Panel connectors
size A4; Author: Michał Gumiela
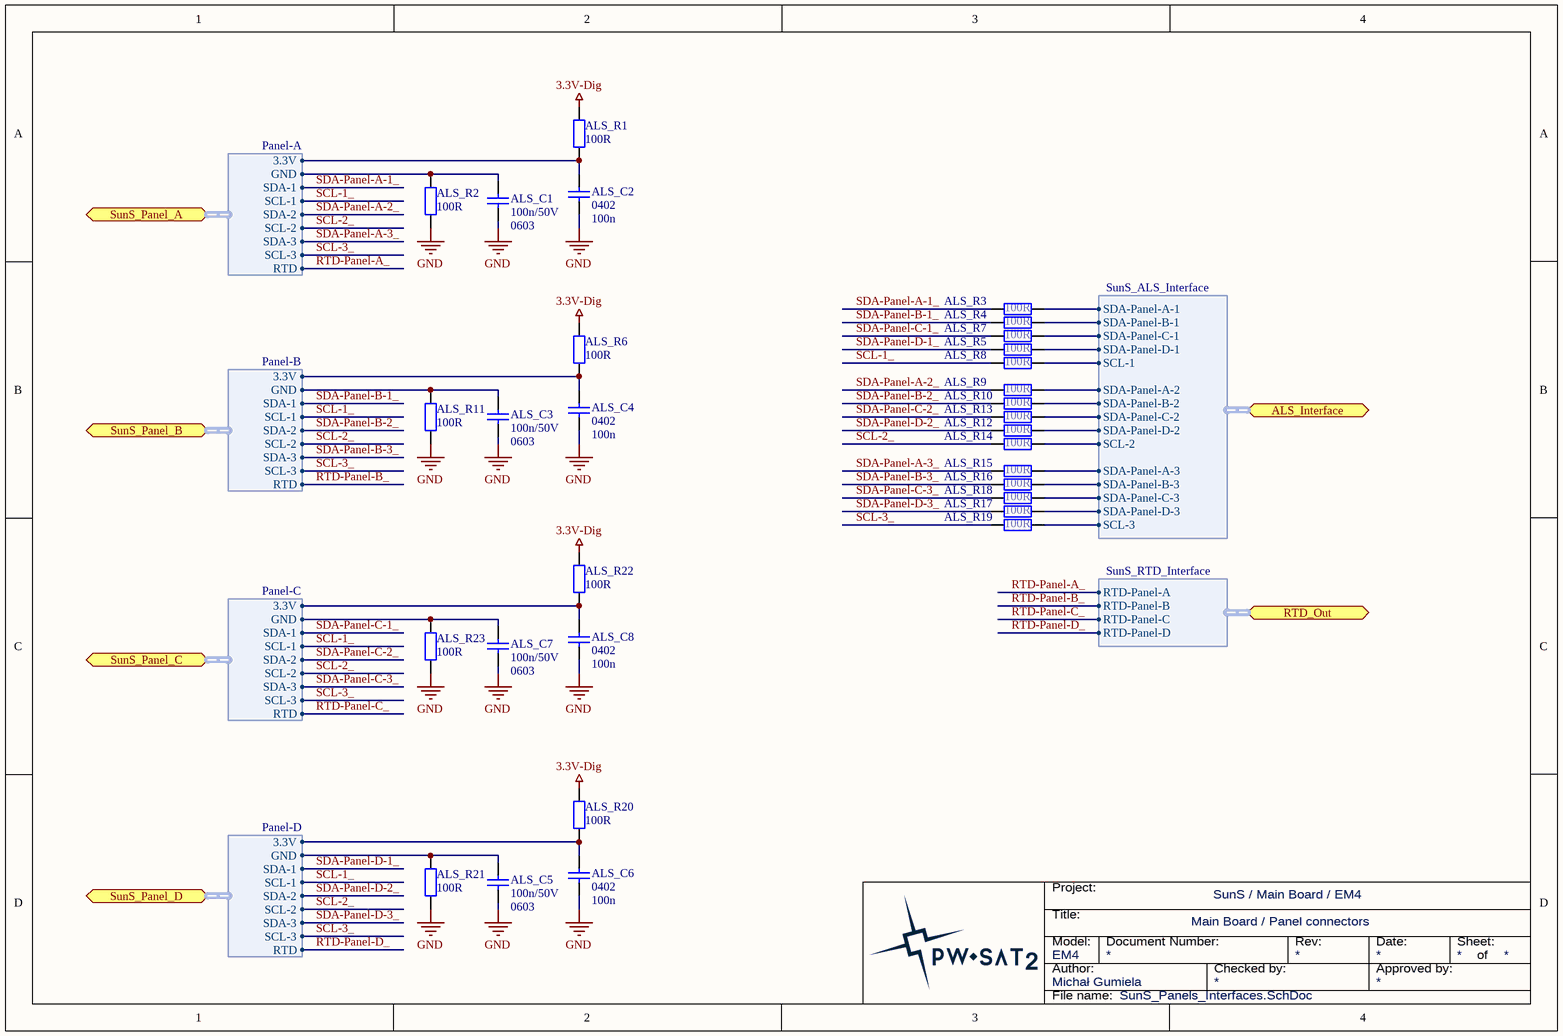
[diagram p7: SunS_Panels_Interfaces.SchDoc]

### Parts
ALS_C1  value 100n/50V  Package: 0603  [SMD_Capacitor_0603]  (hidden comment: Cap)
ALS_C2  0402  value 100n  [SMD_Capacitor_0402]
ALS_C3  value 100n/50V  Package: 0603  [SMD_Capacitor_0603]  (hidden comment: Cap)
ALS_C4  0402  value 100n  [SMD_Capacitor_0402]
ALS_C5  value 100n/50V  Package: 0603  [SMD_Capacitor_0603]  (hidden comment: Cap)
ALS_C6  0402  value 100n  [SMD_Capacitor_0402]
ALS_C7  value 100n/50V  Package: 0603  [SMD_Capacitor_0603]  (hidden comment: Cap)
ALS_C8  0402  value 100n  [SMD_Capacitor_0402]
ALS_R1  100R  [SMD_Resistor_0402]
ALS_R2  100R  [SMD_Resistor_0402]
ALS_R3  100R  [SMD_Resistor_0402]
ALS_R4  100R  [SMD_Resistor_0402]
ALS_R5  100R  [SMD_Resistor_0402]
ALS_R6  100R  [SMD_Resistor_0402]
ALS_R7  100R  [SMD_Resistor_0402]
ALS_R8  100R  [SMD_Resistor_0402]
ALS_R9  100R  [SMD_Resistor_0402]
ALS_R10  100R  [SMD_Resistor_0402]
ALS_R11  100R  [SMD_Resistor_0402]
ALS_R12  100R  [SMD_Resistor_0402]
ALS_R13  100R  [SMD_Resistor_0402]
ALS_R14  100R  [SMD_Resistor_0402]
ALS_R15  100R  [SMD_Resistor_0402]
ALS_R16  100R  [SMD_Resistor_0402]
ALS_R17  100R  [SMD_Resistor_0402]
ALS_R18  100R  [SMD_Resistor_0402]
ALS_R19  100R  [SMD_Resistor_0402]
ALS_R20  100R  [SMD_Resistor_0402]
ALS_R21  100R  [SMD_Resistor_0402]
ALS_R22  100R  [SMD_Resistor_0402]
ALS_R23  100R  [SMD_Resistor_0402]

### Ports
ALS_Interface (harness SunS_ALS_Interface), RTD_Out (harness SunS_RTD_Interface), SunS_Panel_A (harness Panel-A), SunS_Panel_B (harness Panel-B), SunS_Panel_C (harness Panel-C), SunS_Panel_D (harness Panel-D)

### Harnesses
SunS_ALS_Interface: SDA-Panel-A-1, SDA-Panel-D-1, SDA-Panel-B-1, SDA-Panel-C-1, SCL-1, SDA-Panel-A-2, SDA-Panel-D-2, SDA-Panel-B-2, SDA-Panel-C-2, SCL-2, SDA-Panel-A-3, SDA-Panel-D-3, SDA-Panel-B-3, SDA-Panel-C-3, SCL-3
SunS_RTD_Interface: RTD-Panel-A, RTD-Panel-B, RTD-Panel-C, RTD-Panel-D
Panel-B: 3.3V, GND, SDA-1, SCL-1, SDA-2, SCL-2, SDA-3, SCL-3, RTD
Panel-C: 3.3V, GND, SDA-1, SCL-1, SDA-2, SCL-2, SDA-3, SCL-3, RTD
Panel-D: 3.3V, GND, SDA-1, SCL-1, SDA-2, SCL-2, SDA-3, SCL-3, RTD
Panel-A: 3.3V, GND, SDA-1, SCL-1, SDA-2, SCL-2, SDA-3, SCL-3, RTD

### Nets
3.3V-Dig: ALS_R1.2 ALS_R6.2 ALS_R20.2 ALS_R22.2
GND: ALS_C1.2 ALS_C2.1 ALS_C3.2 ALS_C4.1 ALS_C5.2 ALS_C6.1 ALS_C7.2 ALS_C8.1 ALS_R2.1 ALS_R11.1 ALS_R21.1 ALS_R23.1
RTD-Panel-A_: port RTD_Out.RTD-Panel-A, port SunS_Panel_A.RTD
RTD-Panel-B_: port RTD_Out.RTD-Panel-B, port SunS_Panel_B.RTD
RTD-Panel-C_: port RTD_Out.RTD-Panel-C, port SunS_Panel_C.RTD
RTD-Panel-D_: port RTD_Out.RTD-Panel-D, port SunS_Panel_D.RTD
SCL-1: ALS_R8.1 ; port ALS_Interface.SCL-1
SCL-1_: ALS_R8.2 ; port SunS_Panel_B.SCL-1, port SunS_Panel_C.SCL-1, port SunS_Panel_D.SCL-1, port SunS_Panel_A.SCL-1
SCL-2: ALS_R14.1 ; port ALS_Interface.SCL-2
SCL-2_: ALS_R14.2 ; port SunS_Panel_B.SCL-2, port SunS_Panel_C.SCL-2, port SunS_Panel_D.SCL-2, port SunS_Panel_A.SCL-2
SCL-3: ALS_R19.1 ; port ALS_Interface.SCL-3
SCL-3_: ALS_R19.2 ; port SunS_Panel_B.SCL-3, port SunS_Panel_C.SCL-3, port SunS_Panel_D.SCL-3, port SunS_Panel_A.SCL-3
SDA-Panel-A-1: ALS_R3.1 ; port ALS_Interface.SDA-Panel-A-1
SDA-Panel-A-1_: ALS_R3.2 ; port SunS_Panel_A.SDA-1
SDA-Panel-A-2: ALS_R9.1 ; port ALS_Interface.SDA-Panel-A-2
SDA-Panel-A-2_: ALS_R9.2 ; port SunS_Panel_A.SDA-2
SDA-Panel-A-3: ALS_R15.1 ; port ALS_Interface.SDA-Panel-A-3
SDA-Panel-A-3_: ALS_R15.2 ; port SunS_Panel_A.SDA-3
SDA-Panel-B-1: ALS_R4.1 ; port ALS_Interface.SDA-Panel-B-1
SDA-Panel-B-1_: ALS_R4.2 ; port SunS_Panel_B.SDA-1
SDA-Panel-B-2: ALS_R10.1 ; port ALS_Interface.SDA-Panel-B-2
SDA-Panel-B-2_: ALS_R10.2 ; port SunS_Panel_B.SDA-2
SDA-Panel-B-3: ALS_R16.1 ; port ALS_Interface.SDA-Panel-B-3
SDA-Panel-B-3_: ALS_R16.2 ; port SunS_Panel_B.SDA-3
SDA-Panel-C-1: ALS_R7.1 ; port ALS_Interface.SDA-Panel-C-1
SDA-Panel-C-1_: ALS_R7.2 ; port SunS_Panel_C.SDA-1
SDA-Panel-C-2: ALS_R13.1 ; port ALS_Interface.SDA-Panel-C-2
SDA-Panel-C-2_: ALS_R13.2 ; port SunS_Panel_C.SDA-2
SDA-Panel-C-3: ALS_R18.1 ; port ALS_Interface.SDA-Panel-C-3
SDA-Panel-C-3_: ALS_R18.2 ; port SunS_Panel_C.SDA-3
SDA-Panel-D-1: ALS_R5.1 ; port ALS_Interface.SDA-Panel-D-1
SDA-Panel-D-1_: ALS_R5.2 ; port SunS_Panel_D.SDA-1
SDA-Panel-D-2: ALS_R12.1 ; port ALS_Interface.SDA-Panel-D-2
SDA-Panel-D-2_: ALS_R12.2 ; port SunS_Panel_D.SDA-2
SDA-Panel-D-3: ALS_R17.1 ; port ALS_Interface.SDA-Panel-D-3
SDA-Panel-D-3_: ALS_R17.2 ; port SunS_Panel_D.SDA-3
NetALS_C1_1: ALS_C1.1 ALS_R2.2 ; port SunS_Panel_A.GND
NetALS_C2_2: ALS_C2.2 ALS_R1.1 ; port SunS_Panel_A.3.3V
NetALS_C3_1: ALS_C3.1 ALS_R11.2 ; port SunS_Panel_B.GND
NetALS_C4_2: ALS_C4.2 ALS_R6.1 ; port SunS_Panel_B.3.3V
NetALS_C5_1: ALS_C5.1 ALS_R21.2 ; port SunS_Panel_D.GND
NetALS_C6_2: ALS_C6.2 ALS_R20.1 ; port SunS_Panel_D.3.3V
NetALS_C7_1: ALS_C7.1 ALS_R23.2 ; port SunS_Panel_C.GND
NetALS_C8_2: ALS_C8.2 ALS_R22.1 ; port SunS_Panel_C.3.3V

### Notes on the sheet
- Title:
- Project:
- Author:
- Model:
- Document Number:
- Checked by:
- Rev:
- Date:
- Approved by:
- Sheet:
- of
- File name:

### Library data of the parts
ALS_C2 ALS_C4 ALS_C6 ALS_C8 = Cap: Capacitor; Published: 8-Jun-2000; LatestRevisionDate: 17-Jul-2002; LatestRevisionNote: Re-released for DXP Platform.; PackageReference: RAD-0.3; Publisher: Altium Limited; PackageDescription: Radial Cap, Thru-Hole; 2 Leads; 0.3 in Pin Spacing
ALS_R1-ALS_R23 = CRCW040210R0FKxxxx: 10R/1% Vishay CRCW 0402 Resistor. 63mW, 100ppm, 50V.; Manufacturer: Vishay; ManufacturerPartNumber: CRCW040210R0FKxxxx; Value: 100R; Package: 0402

## Sheet SunS_ALS_Interface_Pull_Ups.SchDoc: ALS Interface Pull Ups
size A3; Author: Michał Gumiela
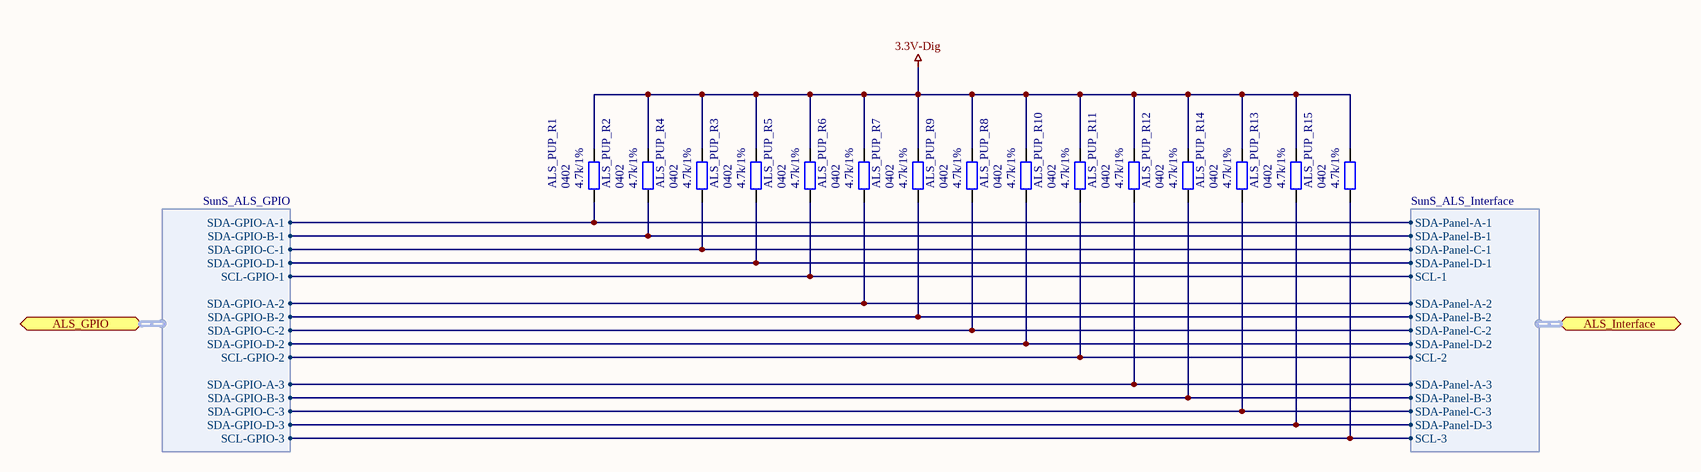
[diagram p8: SunS_ALS_Interface_Pull_Ups.SchDoc]

### Parts
ALS_PUP_R1  Package: 0402  [SMD_Resistor_0402]  (hidden comment: 4.7k/1%)
ALS_PUP_R2  Package: 0402  [SMD_Resistor_0402]  (hidden comment: 4.7k/1%)
ALS_PUP_R3  Package: 0402  [SMD_Resistor_0402]  (hidden comment: 4.7k/1%)
ALS_PUP_R4  Package: 0402  [SMD_Resistor_0402]  (hidden comment: 4.7k/1%)
ALS_PUP_R5  Package: 0402  [SMD_Resistor_0402]  (hidden comment: 4.7k/1%)
ALS_PUP_R6  Package: 0402  [SMD_Resistor_0402]  (hidden comment: 4.7k/1%)
ALS_PUP_R7  Package: 0402  [SMD_Resistor_0402]  (hidden comment: 4.7k/1%)
ALS_PUP_R8  Package: 0402  [SMD_Resistor_0402]  (hidden comment: 4.7k/1%)
ALS_PUP_R9  Package: 0402  [SMD_Resistor_0402]  (hidden comment: 4.7k/1%)
ALS_PUP_R10  Package: 0402  [SMD_Resistor_0402]  (hidden comment: 4.7k/1%)
ALS_PUP_R11  Package: 0402  [SMD_Resistor_0402]  (hidden comment: 4.7k/1%)
ALS_PUP_R12  Package: 0402  [SMD_Resistor_0402]  (hidden comment: 4.7k/1%)
ALS_PUP_R13  Package: 0402  [SMD_Resistor_0402]  (hidden comment: 4.7k/1%)
ALS_PUP_R14  Package: 0402  [SMD_Resistor_0402]  (hidden comment: 4.7k/1%)
ALS_PUP_R15  Package: 0402  [SMD_Resistor_0402]  (hidden comment: 4.7k/1%)

### Ports
ALS_GPIO (harness SunS_ALS_GPIO), ALS_Interface (harness SunS_ALS_Interface)

### Harnesses
SunS_ALS_Interface: SDA-Panel-A-1, SDA-Panel-D-1, SDA-Panel-B-1, SDA-Panel-C-1, SCL-1, SDA-Panel-A-2, SDA-Panel-D-2, SDA-Panel-B-2, SDA-Panel-C-2, SCL-2, SDA-Panel-A-3, SDA-Panel-D-3, SDA-Panel-B-3, SDA-Panel-C-3, SCL-3
SunS_ALS_GPIO: SDA-GPIO-A-1, SDA-GPIO-D-1, SDA-GPIO-B-1, SDA-GPIO-C-1, SCL-GPIO-1, SDA-GPIO-A-2, SDA-GPIO-D-2, SDA-GPIO-B-2, SDA-GPIO-C-2, SCL-GPIO-2, SDA-GPIO-A-3, SDA-GPIO-D-3, SDA-GPIO-B-3, SDA-GPIO-C-3, SCL-GPIO-3

### Nets
3.3V-Dig: ALS_PUP_R1.1 ALS_PUP_R2.1 ALS_PUP_R3.1 ALS_PUP_R4.1 ALS_PUP_R5.1 ALS_PUP_R6.1 ALS_PUP_R7.1 ALS_PUP_R8.1 ALS_PUP_R9.1 ALS_PUP_R10.1 ALS_PUP_R11.1 ALS_PUP_R12.1 ALS_PUP_R13.1 ALS_PUP_R14.1 ALS_PUP_R15.1
SCL-1: ALS_PUP_R5.2 ; port ALS_Interface.SCL-1, port ALS_GPIO.SCL-GPIO-1
SCL-2: ALS_PUP_R10.2 ; port ALS_Interface.SCL-2, port ALS_GPIO.SCL-GPIO-2
SCL-3: ALS_PUP_R15.2 ; port ALS_Interface.SCL-3, port ALS_GPIO.SCL-GPIO-3
SDA-Panel-A-1: ALS_PUP_R1.2 ; port ALS_Interface.SDA-Panel-A-1, port ALS_GPIO.SDA-GPIO-A-1
SDA-Panel-A-2: ALS_PUP_R6.2 ; port ALS_Interface.SDA-Panel-A-2, port ALS_GPIO.SDA-GPIO-A-2
SDA-Panel-A-3: ALS_PUP_R11.2 ; port ALS_Interface.SDA-Panel-A-3, port ALS_GPIO.SDA-GPIO-A-3
SDA-Panel-B-1: ALS_PUP_R2.2 ; port ALS_Interface.SDA-Panel-B-1, port ALS_GPIO.SDA-GPIO-B-1
SDA-Panel-B-2: ALS_PUP_R7.2 ; port ALS_Interface.SDA-Panel-B-2, port ALS_GPIO.SDA-GPIO-B-2
SDA-Panel-B-3: ALS_PUP_R12.2 ; port ALS_Interface.SDA-Panel-B-3, port ALS_GPIO.SDA-GPIO-B-3
SDA-Panel-C-1: ALS_PUP_R4.2 ; port ALS_Interface.SDA-Panel-C-1, port ALS_GPIO.SDA-GPIO-C-1
SDA-Panel-C-2: ALS_PUP_R9.2 ; port ALS_Interface.SDA-Panel-C-2, port ALS_GPIO.SDA-GPIO-C-2
SDA-Panel-C-3: ALS_PUP_R14.2 ; port ALS_Interface.SDA-Panel-C-3, port ALS_GPIO.SDA-GPIO-C-3
SDA-Panel-D-1: ALS_PUP_R3.2 ; port ALS_Interface.SDA-Panel-D-1, port ALS_GPIO.SDA-GPIO-D-1
SDA-Panel-D-2: ALS_PUP_R8.2 ; port ALS_Interface.SDA-Panel-D-2, port ALS_GPIO.SDA-GPIO-D-2
SDA-Panel-D-3: ALS_PUP_R13.2 ; port ALS_Interface.SDA-Panel-D-3, port ALS_GPIO.SDA-GPIO-D-3

### Notes on the sheet
- Title:
- Project:
- Author:
- Model:
- Document Number:
- Checked by:
- Rev:
- Date:
- Approved by:
- Sheet:
- of
- File name:

### Library data of the parts
ALS_PUP_R1-ALS_PUP_R15 = CRCW04024K70FKxxxx: 4.7k/1% Vishay CRCW 0402 Resistor. 63mW, 100ppm, 50V.; ManufacturerPartNumber: CRCW04024K70FKxxxx; Manufacturer: Vishay; Value: 4.7k/1%

## Nets that join several sheets
1.225-Ref: SunS_MCU (MCU_C4.2 MCU_U1.29), SunS_RTD_Interface (RTD_R1.1 RTD_R2.1 RTD_R3.1 RTD_R4.1), SunS_1v225_Reference (REF_C2.1 REF_C3.1 REF_R1.2 REF_U1.1)
3.3V-Bus: SunS_Connectors (SunS_3V3_Bus.1), SunS_Power_Unit (PSU_FB1.2)
3.3V-Dig: SunS_MCU (16 pins), SunS_Power_Unit (PSU_C1.1 PSU_C2.1 PSU_FB1.1), SunS_1v225_Reference (REF_R1.1), SunS_Structure_Thermometer (ST_R2.1), SunS_Panels_Interfaces (ALS_R1.2 ALS_R6.2 ALS_R20.2 ALS_R22.2), SunS_ALS_Interface_Pull_Ups (15 pins)
GND: SunS_Connectors (10 pins), SunS_MCU (11 pins), SunS_Power_Unit (PSU_C1.2 PSU_C2.2), SunS_RTD_Interface (RTD_C5.1 RTD_C6.1 RTD_C7.1 RTD_C8.1), SunS_1v225_Reference (REF_C2.2 REF_C3.2 REF_U1.2 REF_U1.3), SunS_Structure_Thermometer (ST_C1.1 ST_C2.2 ST_U1.3), SunS_Panels_Interfaces (12 pins)
AT_NRST: SunS_Connectors (NRST.1), SunS_MCU (MCU_C1.2 MCU_R1.1 MCU_U1.4)
MCU_RXD: SunS_Connectors (MCU-RXD.1), SunS_MCU (MCU_U1.9 R6.2)
MCU_TXD: SunS_Connectors (MCU-TXD.1), SunS_MCU (MCU_U1.10 R5.2)
NetALS_C1_1: SunS_Connectors (K-Panel-A.2), SunS_Panels_Interfaces (ALS_C1.1 ALS_R2.2)
NetALS_C2_2: SunS_Connectors (K-Panel-A.1), SunS_Panels_Interfaces (ALS_C2.2 ALS_R1.1)
NetALS_C3_1: SunS_Connectors (K-Panel-B.2), SunS_Panels_Interfaces (ALS_C3.1 ALS_R11.2)
NetALS_C4_2: SunS_Connectors (K-Panel-B.1), SunS_Panels_Interfaces (ALS_C4.2 ALS_R6.1)
NetALS_C5_1: SunS_Connectors (K-Panel-D.2), SunS_Panels_Interfaces (ALS_C5.1 ALS_R21.2)
NetALS_C6_2: SunS_Connectors (K-Panel-D.1), SunS_Panels_Interfaces (ALS_C6.2 ALS_R20.1)
NetALS_C7_1: SunS_Connectors (K-Panel-C.2), SunS_Panels_Interfaces (ALS_C7.1 ALS_R23.2)
NetALS_C8_2: SunS_Connectors (K-Panel-C.1), SunS_Panels_Interfaces (ALS_C8.2 ALS_R22.1)
NetMCU_R2_2: SunS_Connectors (SunS_SCL.1), SunS_MCU (MCU_R2.2)
NetMCU_R3_2: SunS_Connectors (SunS_SDA.1), SunS_MCU (MCU_R3.2)
NetMCU_R5_2: SunS_Connectors (SunS_IRQ.1), SunS_MCU (MCU_R5.2)
NetMCU_U1_33: SunS_MCU (MCU_U1.33), SunS_Structure_Thermometer (ST_C1.2 ST_R1.2)
RTD-Panel-A_: SunS_Connectors (K-Panel-A.9), SunS_RTD_Interface (RTD_R3.2 RTD_R7.1)
RTD-Panel-B_: SunS_Connectors (K-Panel-B.9), SunS_RTD_Interface (RTD_R2.2 RTD_R6.1)
RTD-Panel-C_: SunS_Connectors (K-Panel-C.9), SunS_RTD_Interface (RTD_R1.2 RTD_R5.1)
RTD-Panel-D_: SunS_Connectors (K-Panel-D.9), SunS_RTD_Interface (RTD_R4.2 RTD_R8.1)
RTD_Panel_A: SunS_MCU (MCU_U1.35), SunS_RTD_Interface (RTD_C7.2 RTD_R7.2)
RTD_Panel_B: SunS_MCU (MCU_U1.36), SunS_RTD_Interface (RTD_C6.2 RTD_R6.2)
RTD_Panel_C: SunS_MCU (MCU_U1.37), SunS_RTD_Interface (RTD_C5.2 RTD_R5.2)
RTD_Panel_D: SunS_MCU (MCU_U1.34), SunS_RTD_Interface (RTD_C8.2 RTD_R8.2)
SCL-1: SunS_MCU (MCU_U1.3), SunS_Panels_Interfaces (ALS_R8.1), SunS_ALS_Interface_Pull_Ups (ALS_PUP_R5.2)
SCL-1_: SunS_Connectors (K-Panel-A.7 K-Panel-B.7 K-Panel-C.3 K-Panel-D.3), SunS_Panels_Interfaces (ALS_R8.2)
SCL-2: SunS_MCU (MCU_U1.41), SunS_Panels_Interfaces (ALS_R14.1), SunS_ALS_Interface_Pull_Ups (ALS_PUP_R10.2)
SCL-2_: SunS_Connectors (K-Panel-A.5 K-Panel-B.5 K-Panel-C.5 K-Panel-D.5), SunS_Panels_Interfaces (ALS_R14.2)
SCL-3: SunS_MCU (MCU_U1.13), SunS_Panels_Interfaces (ALS_R19.1), SunS_ALS_Interface_Pull_Ups (ALS_PUP_R15.2)
SCL-3_: SunS_Connectors (K-Panel-A.3 K-Panel-B.3 K-Panel-C.7 K-Panel-D.7), SunS_Panels_Interfaces (ALS_R19.2)
SDA-Panel-A-1: SunS_MCU (MCU_U1.16), SunS_Panels_Interfaces (ALS_R3.1), SunS_ALS_Interface_Pull_Ups (ALS_PUP_R1.2)
SDA-Panel-A-1_: SunS_Connectors (K-Panel-A.8), SunS_Panels_Interfaces (ALS_R3.2)
SDA-Panel-A-2: SunS_MCU (MCU_U1.15), SunS_Panels_Interfaces (ALS_R9.1), SunS_ALS_Interface_Pull_Ups (ALS_PUP_R6.2)
SDA-Panel-A-2_: SunS_Connectors (K-Panel-A.6), SunS_Panels_Interfaces (ALS_R9.2)
SDA-Panel-A-3: SunS_MCU (MCU_U1.14), SunS_Panels_Interfaces (ALS_R15.1), SunS_ALS_Interface_Pull_Ups (ALS_PUP_R11.2)
SDA-Panel-A-3_: SunS_Connectors (K-Panel-A.4), SunS_Panels_Interfaces (ALS_R15.2)
SDA-Panel-B-1: SunS_MCU (MCU_U1.11), SunS_Panels_Interfaces (ALS_R4.1), SunS_ALS_Interface_Pull_Ups (ALS_PUP_R2.2)
SDA-Panel-B-1_: SunS_Connectors (K-Panel-B.8), SunS_Panels_Interfaces (ALS_R4.2)
SDA-Panel-B-2: SunS_MCU (MCU_U1.2), SunS_Panels_Interfaces (ALS_R10.1), SunS_ALS_Interface_Pull_Ups (ALS_PUP_R7.2)
SDA-Panel-B-2_: SunS_Connectors (K-Panel-B.6), SunS_Panels_Interfaces (ALS_R10.2)
SDA-Panel-B-3: SunS_MCU (MCU_U1.1), SunS_Panels_Interfaces (ALS_R16.1), SunS_ALS_Interface_Pull_Ups (ALS_PUP_R12.2)
SDA-Panel-B-3_: SunS_Connectors (K-Panel-B.4), SunS_Panels_Interfaces (ALS_R16.2)
SDA-Panel-C-1: SunS_MCU (MCU_U1.40), SunS_Panels_Interfaces (ALS_R7.1), SunS_ALS_Interface_Pull_Ups (ALS_PUP_R4.2)
SDA-Panel-C-1_: SunS_Connectors (K-Panel-C.4), SunS_Panels_Interfaces (ALS_R7.2)
SDA-Panel-C-2: SunS_MCU (MCU_U1.43), SunS_Panels_Interfaces (ALS_R13.1), SunS_ALS_Interface_Pull_Ups (ALS_PUP_R9.2)
SDA-Panel-C-2_: SunS_Connectors (K-Panel-C.6), SunS_Panels_Interfaces (ALS_R13.2)
SDA-Panel-C-3: SunS_MCU (MCU_U1.44), SunS_Panels_Interfaces (ALS_R18.1), SunS_ALS_Interface_Pull_Ups (ALS_PUP_R14.2)
SDA-Panel-C-3_: SunS_Connectors (K-Panel-C.8), SunS_Panels_Interfaces (ALS_R18.2)
SDA-Panel-D-1: SunS_MCU (MCU_U1.30), SunS_Panels_Interfaces (ALS_R5.1), SunS_ALS_Interface_Pull_Ups (ALS_PUP_R3.2)
SDA-Panel-D-1_: SunS_Connectors (K-Panel-D.4), SunS_Panels_Interfaces (ALS_R5.2)
SDA-Panel-D-2: SunS_MCU (MCU_U1.31), SunS_Panels_Interfaces (ALS_R12.1), SunS_ALS_Interface_Pull_Ups (ALS_PUP_R8.2)
SDA-Panel-D-2_: SunS_Connectors (K-Panel-D.6), SunS_Panels_Interfaces (ALS_R12.2)
SDA-Panel-D-3: SunS_MCU (MCU_U1.32), SunS_Panels_Interfaces (ALS_R17.1), SunS_ALS_Interface_Pull_Ups (ALS_PUP_R13.2)
SDA-Panel-D-3_: SunS_Connectors (K-Panel-D.8), SunS_Panels_Interfaces (ALS_R17.2)
TCK: SunS_Connectors (TCK.1), SunS_MCU (MCU_U1.21 R4.2)
TDI: SunS_Connectors (TDI.1), SunS_MCU (MCU_U1.24 R1.2)
TDO: SunS_Connectors (TDO.1), SunS_MCU (MCU_U1.23 R2.2)
TMS: SunS_Connectors (TMS.1), SunS_MCU (MCU_U1.22 R3.2)